# EAGLE design Operant-Front (EAGLE 9.6.2)
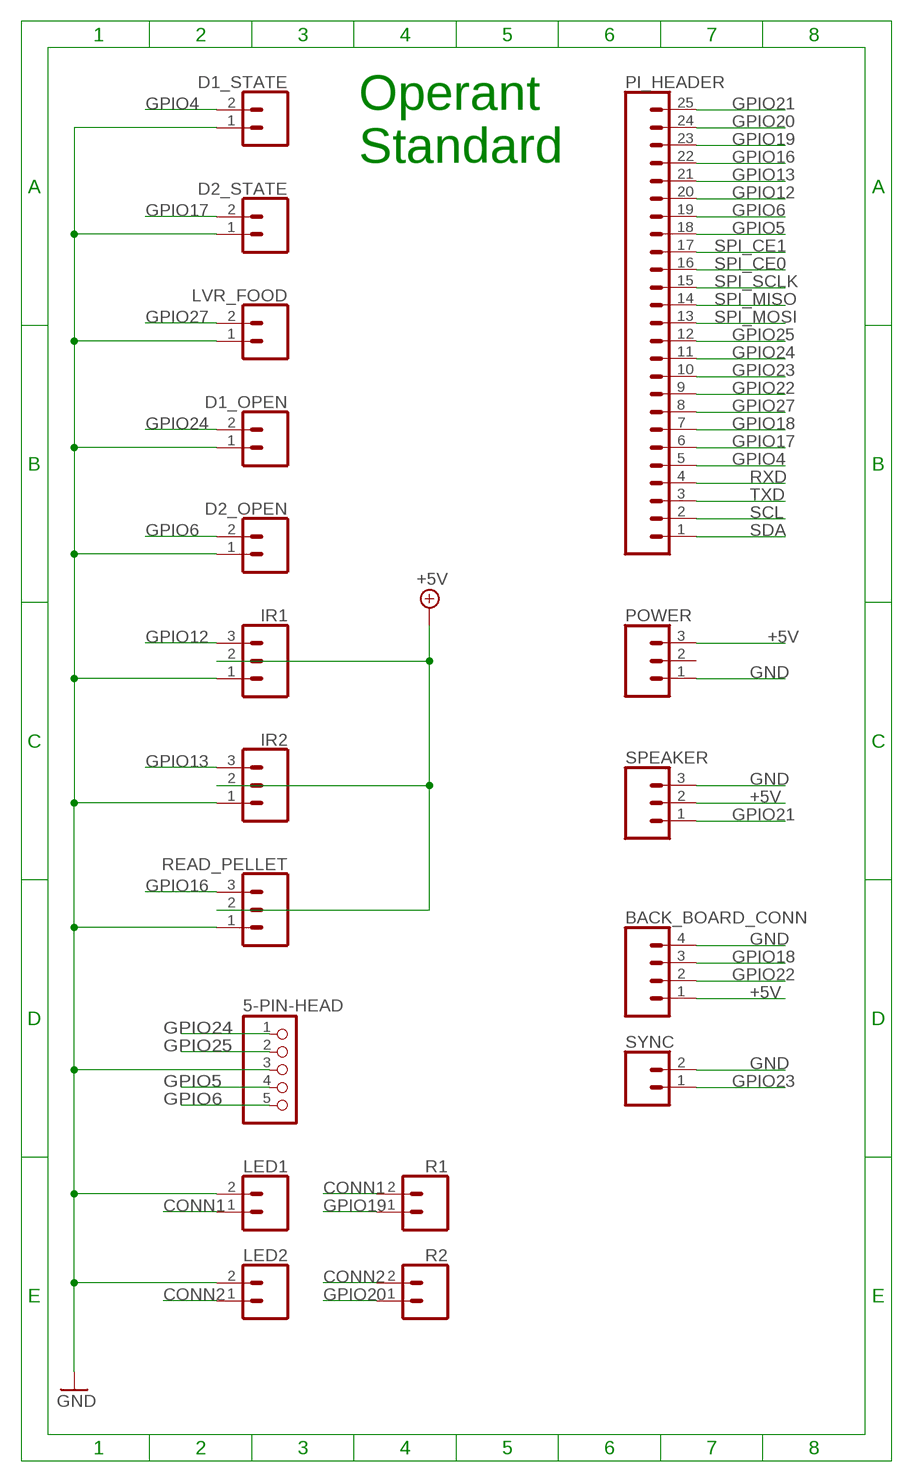
[diagram p0: schematic, sheet 1]

## Parts
5-PIN-HEAD  PINHD-1X5  [1X05]
BACK_BOARD_CONN  CONN_04JST-PTH  [JST-4-PTH]
D1_OPEN  CONN_02JST-PTH-2  [JST-2-PTH]
D1_STATE  CONN_02JST-PTH-2  [JST-2-PTH]
D2_OPEN  CONN_02JST-PTH-2  [JST-2-PTH]
D2_STATE  CONN_02JST-PTH-2  [JST-2-PTH]
IR1  CONN_03JST-PTH  [JST-3-PTH]
IR2  CONN_03JST-PTH  [JST-3-PTH]
LED1  CONN_02  [1X02]
LED2  CONN_02  [1X02]
LVR_FOOD  CONN_02JST-PTH-2  [JST-2-PTH]
PI_HEADER  CONN_25  [1X25]
POWER  CONN_03  [1X03]
R1  CONN_02  [1X02]
R2  CONN_02  [1X02]
READ_PELLET  CONN_03JST-PTH  [JST-3-PTH]
SPEAKER  CONN_03JST-PTH  [JST-3-PTH]
SYNC  CONN_02  [1X02]

## Nets
+5V: BACK_BOARD_CONN.1 IR1.2 IR2.2 POWER.3 READ_PELLET.2 SPEAKER.2
CONN1: LED1.1 R1.2
CONN2: LED2.1 R2.2
GND: 5-PIN-HEAD.3 BACK_BOARD_CONN.4 D1_OPEN.1 D1_STATE.1 D2_OPEN.1 D2_STATE.1 IR1.1 IR2.1 LED1.2 LED2.2 LVR_FOOD.1 POWER.1 READ_PELLET.1 SPEAKER.3 SYNC.2
GPIO4: D1_STATE.2 PI_HEADER.5
GPIO5: 5-PIN-HEAD.4 PI_HEADER.18
GPIO6: 5-PIN-HEAD.5 D2_OPEN.2 PI_HEADER.19
GPIO12: IR1.3 PI_HEADER.20
GPIO13: IR2.3 PI_HEADER.21
GPIO16: PI_HEADER.22 READ_PELLET.3
GPIO17: D2_STATE.2 PI_HEADER.6
GPIO18: BACK_BOARD_CONN.3 PI_HEADER.7
GPIO19: PI_HEADER.23 R1.1
GPIO20: PI_HEADER.24 R2.1
GPIO21: PI_HEADER.25 SPEAKER.1
GPIO22: BACK_BOARD_CONN.2 PI_HEADER.9
GPIO23: PI_HEADER.10 SYNC.1
GPIO24: 5-PIN-HEAD.1 D1_OPEN.2 PI_HEADER.11
GPIO25: 5-PIN-HEAD.2 PI_HEADER.12
GPIO27: LVR_FOOD.2 PI_HEADER.8
RXD: PI_HEADER.4
SCL: PI_HEADER.2
SDA: PI_HEADER.1
SPI_CE0: PI_HEADER.16
SPI_CE1: PI_HEADER.17
SPI_MISO: PI_HEADER.14
SPI_MOSI: PI_HEADER.13
SPI_SCLK: PI_HEADER.15
TXD: PI_HEADER.3
Unconnected: POWER.2

## Notes on the sheet
- Operant 
  Standard

## Library data of the parts
5-PIN-HEAD = pinhead:PINHD-1X5: PIN HEADER
BACK_BOARD_CONN = SparkFun-Connectors:CONN_04: Multi connection point. Often used as Generic Header-pin footprint for 0.1 inch spaced/style header connections On any of the 0.1 inch spaced packages, you can populate with these: Break Away Headers - Straight <https://www.sparkfun.com/products/116> (PRT-00116) Break Away Male Headers - Right Angle <https://www.sparkfun.com/products/553> (PRT-00553) Female Headers <https://www.sparkfun.com/products/115> (PRT-00115) Break Away Headers - Machine Pin <https://www.sparkfun.com/products/117> (PRT-00117) Break Away Female Headers - Swiss Machine Pin <https://www.sparkfun.com/products/743> (PRT-00743) For SCREWTERMINALS and SPRING TERMINALS visit here: Screw Terimnals on SparkFun.com <https://www.sparkfun.com/search/results?term=Screw+Terminals> (5mm/3.5mm/2.54mm spacing) This device is also useful as a general connection point to wire up your design to another part of your project. Our various solder wires solder well into these plated through hole pads. Hook-Up Wire - Assortment (Stranded, 22 AWG) <https://www.sparkfun.com/products/11375> (PRT-11375) Hook-Up Wire - Assortment (Solid Core, 22 AWG) <https://www.sparkfun.com/products/11367> (PRT-11367) View the entire wire category on our website here <https://www.sparkfun.com/categories/141> Special notes: Molex polarized connector foot print use with SKU : PRT-08231 with associated crimp pins and housings. 1MM SMD Version SKU: PRT-10208; PROD_ID: WIRE-13531; SF_ID: PRT-09916
D1_OPEN D1_STATE D2_OPEN D2_STATE LVR_FOOD = SparkFun-Connectors:CONN_02: Multi connection point. Often used as Generic Header-pin footprint for 0.1 inch spaced/style header connections On any of the 0.1 inch spaced packages, you can populate with these: Break Away Headers - Straight <https://www.sparkfun.com/products/116> (PRT-00116) Break Away Male Headers - Right Angle <https://www.sparkfun.com/products/553> (PRT-00553) Female Headers <https://www.sparkfun.com/products/115> (PRT-00115) Break Away Headers - Machine Pin <https://www.sparkfun.com/products/117> (PRT-00117) Break Away Female Headers - Swiss Machine Pin <https://www.sparkfun.com/products/743> (PRT-00743) For SCREWTERMINALS and SPRING TERMINALS visit here: Screw Terimnals on SparkFun.com <https://www.sparkfun.com/search/results?term=Screw+Terminals> (5mm/3.5mm/2.54mm spacing) This device is also useful as a general connection point to wire up your design to another part of your project. Our various solder wires solder well into these plated through hole pads. Hook-Up Wire - Assortment (Stranded, 22 AWG) <https://www.sparkfun.com/products/11375> (PRT-11375) Hook-Up Wire - Assortment (Solid Core, 22 AWG) <https://www.sparkfun.com/products/11367> (PRT-11367) View the entire wire category on our website here <https://www.sparkfun.com/categories/141> Special notes: Molex polarized connector foot print use with: PRT-08233 with associated crimp pins and housings. 2.54_SCREWTERM for use with PRT-10571. 3.5mm Screw Terminal footprints for PRT-08084 5mm Screw Terminal footprints for use with PRT-08432; PROD_ID: CONN-09863; SKU: PRT-09914
IR1 IR2 READ_PELLET SPEAKER = SparkFun-Connectors:CONN_03: Multi connection point. Often used as Generic Header-pin footprint for 0.1 inch spaced/style header connections On any of the 0.1 inch spaced packages, you can populate with these: Break Away Headers - Straight <https://www.sparkfun.com/products/116> (PRT-00116) Break Away Male Headers - Right Angle <https://www.sparkfun.com/products/553> (PRT-00553) Female Headers <https://www.sparkfun.com/products/115> (PRT-00115) Break Away Headers - Machine Pin <https://www.sparkfun.com/products/117> (PRT-00117) Break Away Female Headers - Swiss Machine Pin <https://www.sparkfun.com/products/743> (PRT-00743) Stackable Header - 3 Pin (Female, 0.1") <https://www.sparkfun.com/products/13875> (PRT-13875) For SCREWTERMINALS and SPRING TERMINALS visit here: Screw Terimnals on SparkFun.com <https://www.sparkfun.com/search/results?term=Screw+Terminals> (5mm/3.5mm/2.54mm spacing) This device is also useful as a general connection point to wire up your design to another part of your project. Our various solder wires solder well into these plated through hole pads. Hook-Up Wire - Assortment (Stranded, 22 AWG) <https://www.sparkfun.com/products/11375> (PRT-11375) Hook-Up Wire - Assortment (Solid Core, 22 AWG) <https://www.sparkfun.com/products/11367> (PRT-11367) View the entire wire category on our website here <https://www.sparkfun.com/categories/141> Special notes: Molex polarized connector foot print use with SKU : PRT-08232 with associated crimp pins and housings.; PROD_ID: WIRE-10037; SF_ID: PRT-09915
LED1 LED2 R1 R2 SYNC = SparkFun-Connectors:CONN_02: Multi connection point. Often used as Generic Header-pin footprint for 0.1 inch spaced/style header connections On any of the 0.1 inch spaced packages, you can populate with these: Break Away Headers - Straight <https://www.sparkfun.com/products/116> (PRT-00116) Break Away Male Headers - Right Angle <https://www.sparkfun.com/products/553> (PRT-00553) Female Headers <https://www.sparkfun.com/products/115> (PRT-00115) Break Away Headers - Machine Pin <https://www.sparkfun.com/products/117> (PRT-00117) Break Away Female Headers - Swiss Machine Pin <https://www.sparkfun.com/products/743> (PRT-00743) For SCREWTERMINALS and SPRING TERMINALS visit here: Screw Terimnals on SparkFun.com <https://www.sparkfun.com/search/results?term=Screw+Terminals> (5mm/3.5mm/2.54mm spacing) This device is also useful as a general connection point to wire up your design to another part of your project. Our various solder wires solder well into these plated through hole pads. Hook-Up Wire - Assortment (Stranded, 22 AWG) <https://www.sparkfun.com/products/11375> (PRT-11375) Hook-Up Wire - Assortment (Solid Core, 22 AWG) <https://www.sparkfun.com/products/11367> (PRT-11367) View the entire wire category on our website here <https://www.sparkfun.com/categories/141> Special notes: Molex polarized connector foot print use with: PRT-08233 with associated crimp pins and housings. 2.54_SCREWTERM for use with PRT-10571. 3.5mm Screw Terminal footprints for PRT-08084 5mm Screw Terminal footprints for use with PRT-08432
PI_HEADER = SparkFun-Connectors:CONN_25: Multi connection point. Often used as Generic Header-pin footprint for 0.1 inch spaced/style header connections On any of the 0.1 inch spaced packages, you can populate with these: Break Away Headers - Straight <https://www.sparkfun.com/products/116> (PRT-00116) Break Away Male Headers - Right Angle <https://www.sparkfun.com/products/553> (PRT-00553) Female Headers <https://www.sparkfun.com/products/115> (PRT-00115) Break Away Headers - Machine Pin <https://www.sparkfun.com/products/117> (PRT-00117) Break Away Female Headers - Swiss Machine Pin <https://www.sparkfun.com/products/743> (PRT-00743) For SCREWTERMINALS and SPRING TERMINALS visit here: Screw Terimnals on SparkFun.com <https://www.sparkfun.com/search/results?term=Screw+Terminals> (5mm/3.5mm/2.54mm spacing) This device is also useful as a general connection point to wire up your design to another part of your project. Our various solder wires solder well into these plated through hole pads. Hook-Up Wire - Assortment (Stranded, 22 AWG) <https://www.sparkfun.com/products/11375> (PRT-11375) Hook-Up Wire - Assortment (Solid Core, 22 AWG) <https://www.sparkfun.com/products/11367> (PRT-11367) View the entire wire category on our website here <https://www.sparkfun.com/categories/141> Special notes: Molex polarized connector foot print use with SKU : PRT-08231 with associated crimp pins and housings. 1MM SMD Version SKU: PRT-10208 NOTES ON THE VARIANTS LOCK and LOCK_LONGPADS... This footprint was designed to help hold the alignment of a through-hole component (i.e. 6-pin header) while soldering it into place. You may notice that each hole has been shifted either up or down by 0.005 of an inch from it's more standard position (which is a perfectly straight line). This slight alteration caused the pins (the squares in the middle) to touch the edges of the holes. Because they are alternating, it causes a "brace" to hold the component in place. 0.005 has proven to be the perfect amount of "off-center" position when using our standard breakaway headers. Although looks a little odd when you look at the bare footprint, once you have a header in there, the alteration is very hard to notice. Also,if you push a header all the way into place, it is covered up entirely on the bottom side.
POWER = SparkFun-Connectors:CONN_03: Multi connection point. Often used as Generic Header-pin footprint for 0.1 inch spaced/style header connections On any of the 0.1 inch spaced packages, you can populate with these: Break Away Headers - Straight <https://www.sparkfun.com/products/116> (PRT-00116) Break Away Male Headers - Right Angle <https://www.sparkfun.com/products/553> (PRT-00553) Female Headers <https://www.sparkfun.com/products/115> (PRT-00115) Break Away Headers - Machine Pin <https://www.sparkfun.com/products/117> (PRT-00117) Break Away Female Headers - Swiss Machine Pin <https://www.sparkfun.com/products/743> (PRT-00743) Stackable Header - 3 Pin (Female, 0.1") <https://www.sparkfun.com/products/13875> (PRT-13875) For SCREWTERMINALS and SPRING TERMINALS visit here: Screw Terimnals on SparkFun.com <https://www.sparkfun.com/search/results?term=Screw+Terminals> (5mm/3.5mm/2.54mm spacing) This device is also useful as a general connection point to wire up your design to another part of your project. Our various solder wires solder well into these plated through hole pads. Hook-Up Wire - Assortment (Stranded, 22 AWG) <https://www.sparkfun.com/products/11375> (PRT-11375) Hook-Up Wire - Assortment (Solid Core, 22 AWG) <https://www.sparkfun.com/products/11367> (PRT-11367) View the entire wire category on our website here <https://www.sparkfun.com/categories/141> Special notes: Molex polarized connector foot print use with SKU : PRT-08232 with associated crimp pins and housings.; PROD_ID: XXX-00000; VALUE: 455-1750-1-ND

## Board
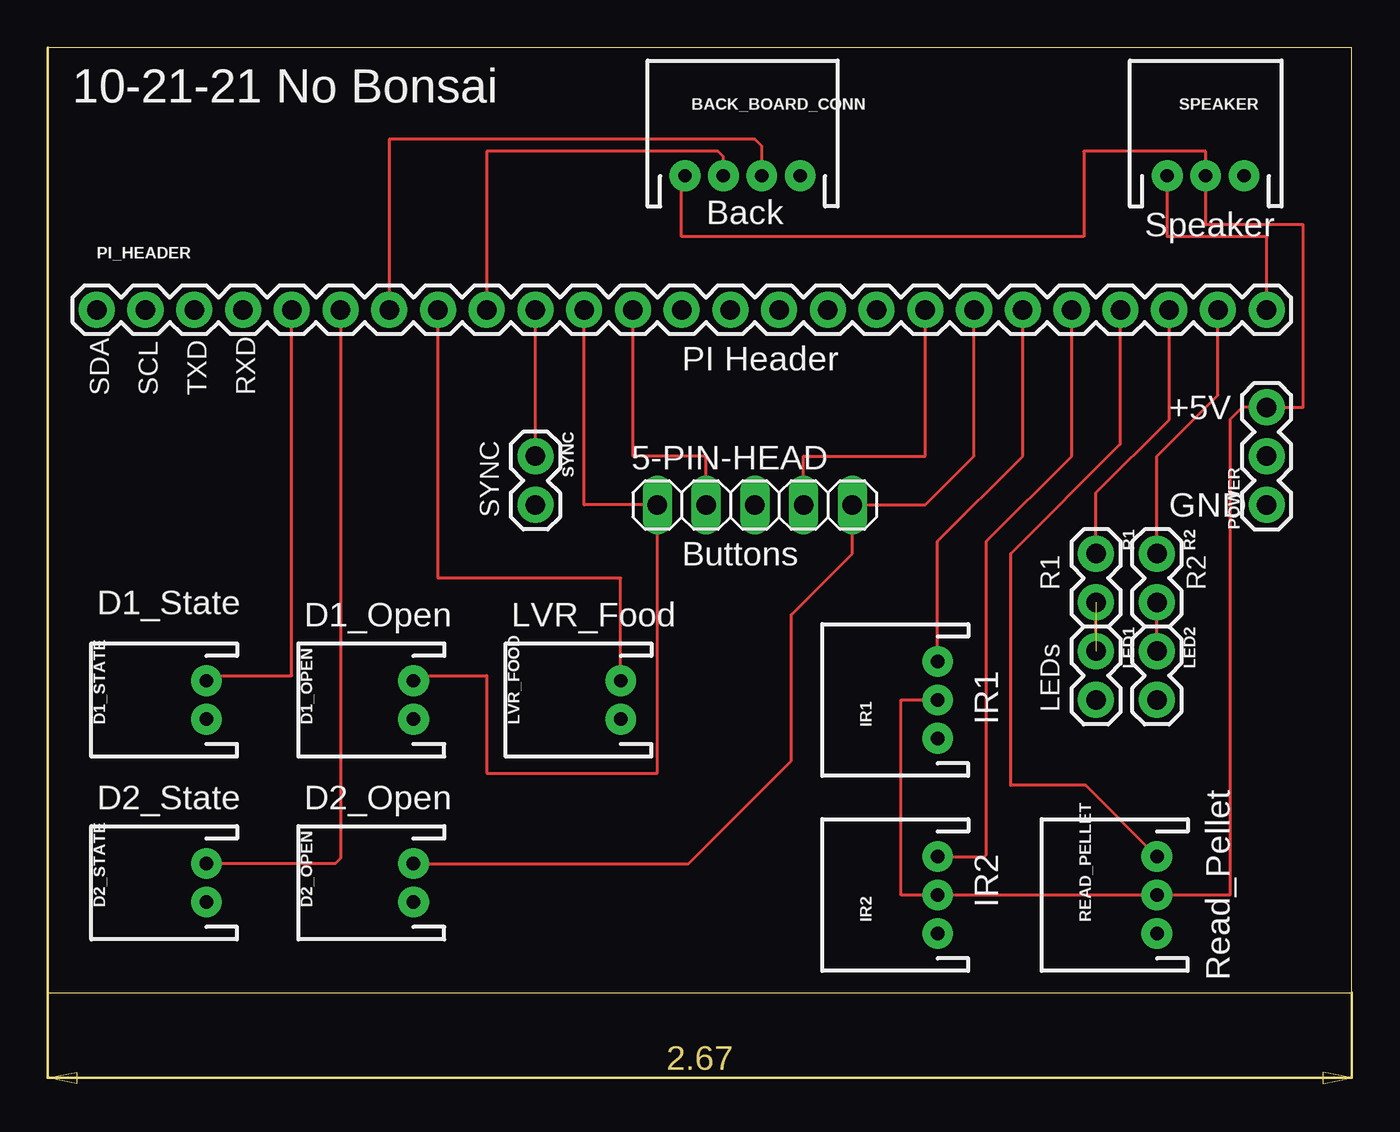
[diagram p1: board, top side]
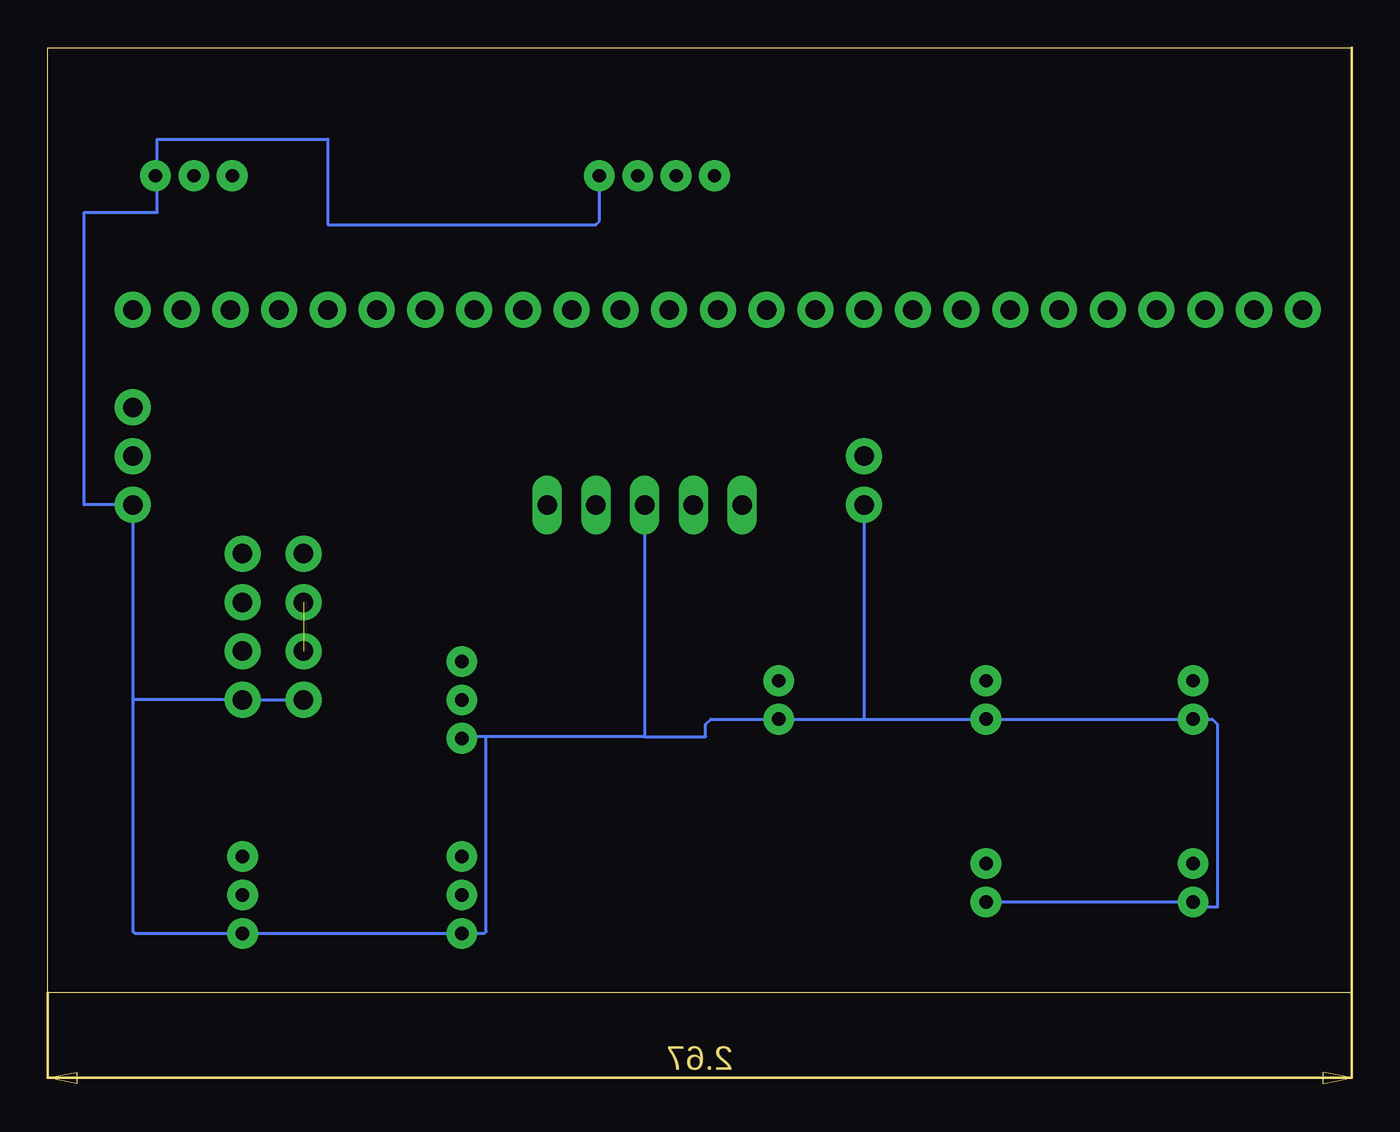
[diagram p2: board, bottom side, seen from below]

Size 67.92 x 49.2 mm. Coordinates in mm from the lower left corner, seen from the top.
Outline: 0,0 67.92,0 67.92,49.2 0,49.2 0,0
Copper layers (1*16): Top 0.035mm / dielectric 1.5mm / Bottom 0.035mm
Design rules "default": minimum track width 6mil, minimum drill 0.35mm, track to track 6mil, track to pad 6mil, pad to pad 6mil, via to via 6mil, smd to smd 6mil, copper to edge 40mil, drill to drill 6mil, minimum pad ring 10mil, minimum via ring 8mil, stop-mask expansion 4mil, vias tented up to drill 0mil, thermal gap 10mil

### Footprints (pad centres in the part's own frame; a part is rotated, then mirrored left to right if it is on the bottom)
1X05 = drill 1.016 long: 1 -5.08,0; 2 -2.54,0; 3 0,0; 4 2.54,0; 5 5.08,0
JST-4-PTH = drill 0.7 pad 1.6: 1 -3,0; 2 -1,0; 3 1,0; 4 3,0
JST-2-PTH = drill 0.7 pad 1.6: 1 -1,0; 2 1,0
JST-3-PTH = drill 0.7 pad 1.6: 1 -2,0; 2 0,0; 3 2,0
1X02 = drill 1.016 pad 1.88: 1 0,0; 2 2.54,0
1X25 = drill 1.016 pad 1.88: 1 0,0; 2 2.54,0; 3 5.08,0; 4 7.62,0; 5 10.16,0; 6 12.7,0; 7 15.24,0; 8 17.78,0; 9 20.32,0; 10 22.86,0; 11 25.4,0; 12 27.94,0; 13 30.48,0; 14 33.02,0; 15 35.56,0; 16 38.1,0; 17 40.64,0; 18 43.18,0; 19 45.72,0; 20 48.26,0; 21 50.8,0; 22 53.34,0; 23 55.88,0; 24 58.42,0; 25 60.96,0
1X03 = drill 1.016 pad 1.88: 1 0,0; 2 2.54,0; 3 5.08,0

### Placement (x,y rotation side)
5-PIN-HEAD  36.83,25.4 0 top
BACK_BOARD_CONN  36.2,42.55 0 top
D1_OPEN  19.05,15.24 90 top
D1_STATE  8.26,15.24 90 top
D2_OPEN  19.05,5.71 90 top
D2_STATE  8.26,5.71 90 top
IR1  46.35,15.24 90 top
IR2  46.35,5.08 90 top
LED1  54.61,17.78 270 top
LED2  57.78,17.78 270 top
LVR_FOOD  29.84,15.24 90 top
PI_HEADER  2.54,35.56 0 top
POWER  63.5,25.4 90 top
R1  54.61,22.86 270 top
R2  57.78,22.86 270 top
READ_PELLET  57.78,5.08 90 top
SPEAKER  60.33,42.55 0 top
SYNC  25.4,27.94 270 top

### Tracks (layer width: path | path; a pad name or v marks a point on that pad's centre or on a via)
+5V
  Top 0.152: IR1.2 44.45,15.24 44.45,5.08 IR2.2 READ_PELLET.2 61.59,5.08 61.59,29.84 62.23,30.48 POWER.3 65.41,30.48 65.41,40.01 60.33,40.01 SPEAKER.2 60.33,43.81 53.98,43.81 53.98,39.37 33.02,39.37 33.02,42.37 BACK_BOARD_CONN.1
CONN1  (1 unrouted)
  Top 0.152: LED1.1 R1.2
CONN2
  Top 0.152: LED2.1 R2.2
GND
  Bottom 0.152: 45.09,13.34 45.09,3.17 45.18,3.08 IR2.1 READ_PELLET.1 63.41,3.08 63.5,3.17 63.5,15.24 | 45.09,13.34 46.26,13.34 IR1.1 | 5-PIN-HEAD.3 36.83,13.34 | 36.83,13.34 45.09,13.34 | 36.83,13.34 33.66,13.34 33.66,13.97 33.38,14.24 LVR_FOOD.1 25.4,14.24 | 25.4,14.24 D1_OPEN.1 D1_STATE.1 7.25,14.24 6.99,13.97 6.99,4.45 7.99,4.45 D2_STATE.1 D2_OPEN.1 | BACK_BOARD_CONN.4 39.2,40.18 39.37,40.01 53.34,40.01 53.34,44.45 62.23,44.45 62.23,42.64 SPEAKER.3 62.23,42.45 62.23,40.64 66.04,40.64 66.04,25.4 POWER.1 63.5,15.24 | SYNC.2 25.4,14.24 | 63.5,15.24 LED2.2 LED1.2
GPIO4
  Top 0.152: D1_STATE.2 8.53,16.51 12.7,16.51 PI_HEADER.5
GPIO5
  Top 0.152: 5-PIN-HEAD.4 39.37,27.94 45.72,27.94 PI_HEADER.18
GPIO6
  Top 0.152: PI_HEADER.19 48.26,27.94 45.72,25.4 5-PIN-HEAD.5 41.91,22.86 38.73,19.68 38.73,12.06 33.38,6.71 D2_OPEN.2
GPIO12
  Top 0.152: PI_HEADER.20 50.8,27.94 46.35,23.5 IR1.3
GPIO13
  Top 0.152: IR2.3 48.8,7.08 48.9,7.17 48.9,23.5 53.34,27.94 PI_HEADER.21
GPIO16
  Top 0.152: READ_PELLET.3 54.07,10.79 50.16,10.79 50.16,22.86 55.88,28.57 PI_HEADER.22
GPIO17
  Top 0.152: PI_HEADER.6 15.24,6.99 14.97,6.71 D2_STATE.2
GPIO18
  Top 0.152: BACK_BOARD_CONN.3 37.2,44.09 36.83,44.45 17.78,44.45 PI_HEADER.7
GPIO19
  Top 0.152: PI_HEADER.23 58.42,29.84 54.61,26.04 R1.1
GPIO20
  Top 0.152: R2.1 57.78,27.94 60.96,31.11 PI_HEADER.24
GPIO21
  Top 0.152: PI_HEADER.25 63.5,39.37 58.33,39.37 SPEAKER.1
GPIO22
  Top 0.152: BACK_BOARD_CONN.2 35.2,43.55 34.92,43.81 22.86,43.81 PI_HEADER.9
GPIO23
  Top 0.152: SYNC.1 PI_HEADER.10
GPIO24
  Top 0.152: PI_HEADER.11 27.94,25.4 5-PIN-HEAD.1 31.75,11.43 22.86,11.43 22.86,16.51 19.32,16.51 D1_OPEN.2
GPIO25
  Top 0.152: 5-PIN-HEAD.2 34.29,27.94 30.48,27.94 PI_HEADER.12
GPIO27
  Top 0.152: LVR_FOOD.2 29.84,21.59 20.32,21.59 PI_HEADER.8

### Text on the board
tPlace: 10-21-21 No Bonsai | Back | Speaker | PI Header | SDA | SCL | TXD | RXD | +5V | SYNC | GND | Buttons | R1 | R2 | D1_State | D1_Open | LVR_Food | LEDs | IR1 | D2_State | D2_Open | IR2 | Read_Pellet